# Altium schematic sheet 从机.SchDoc
size A2
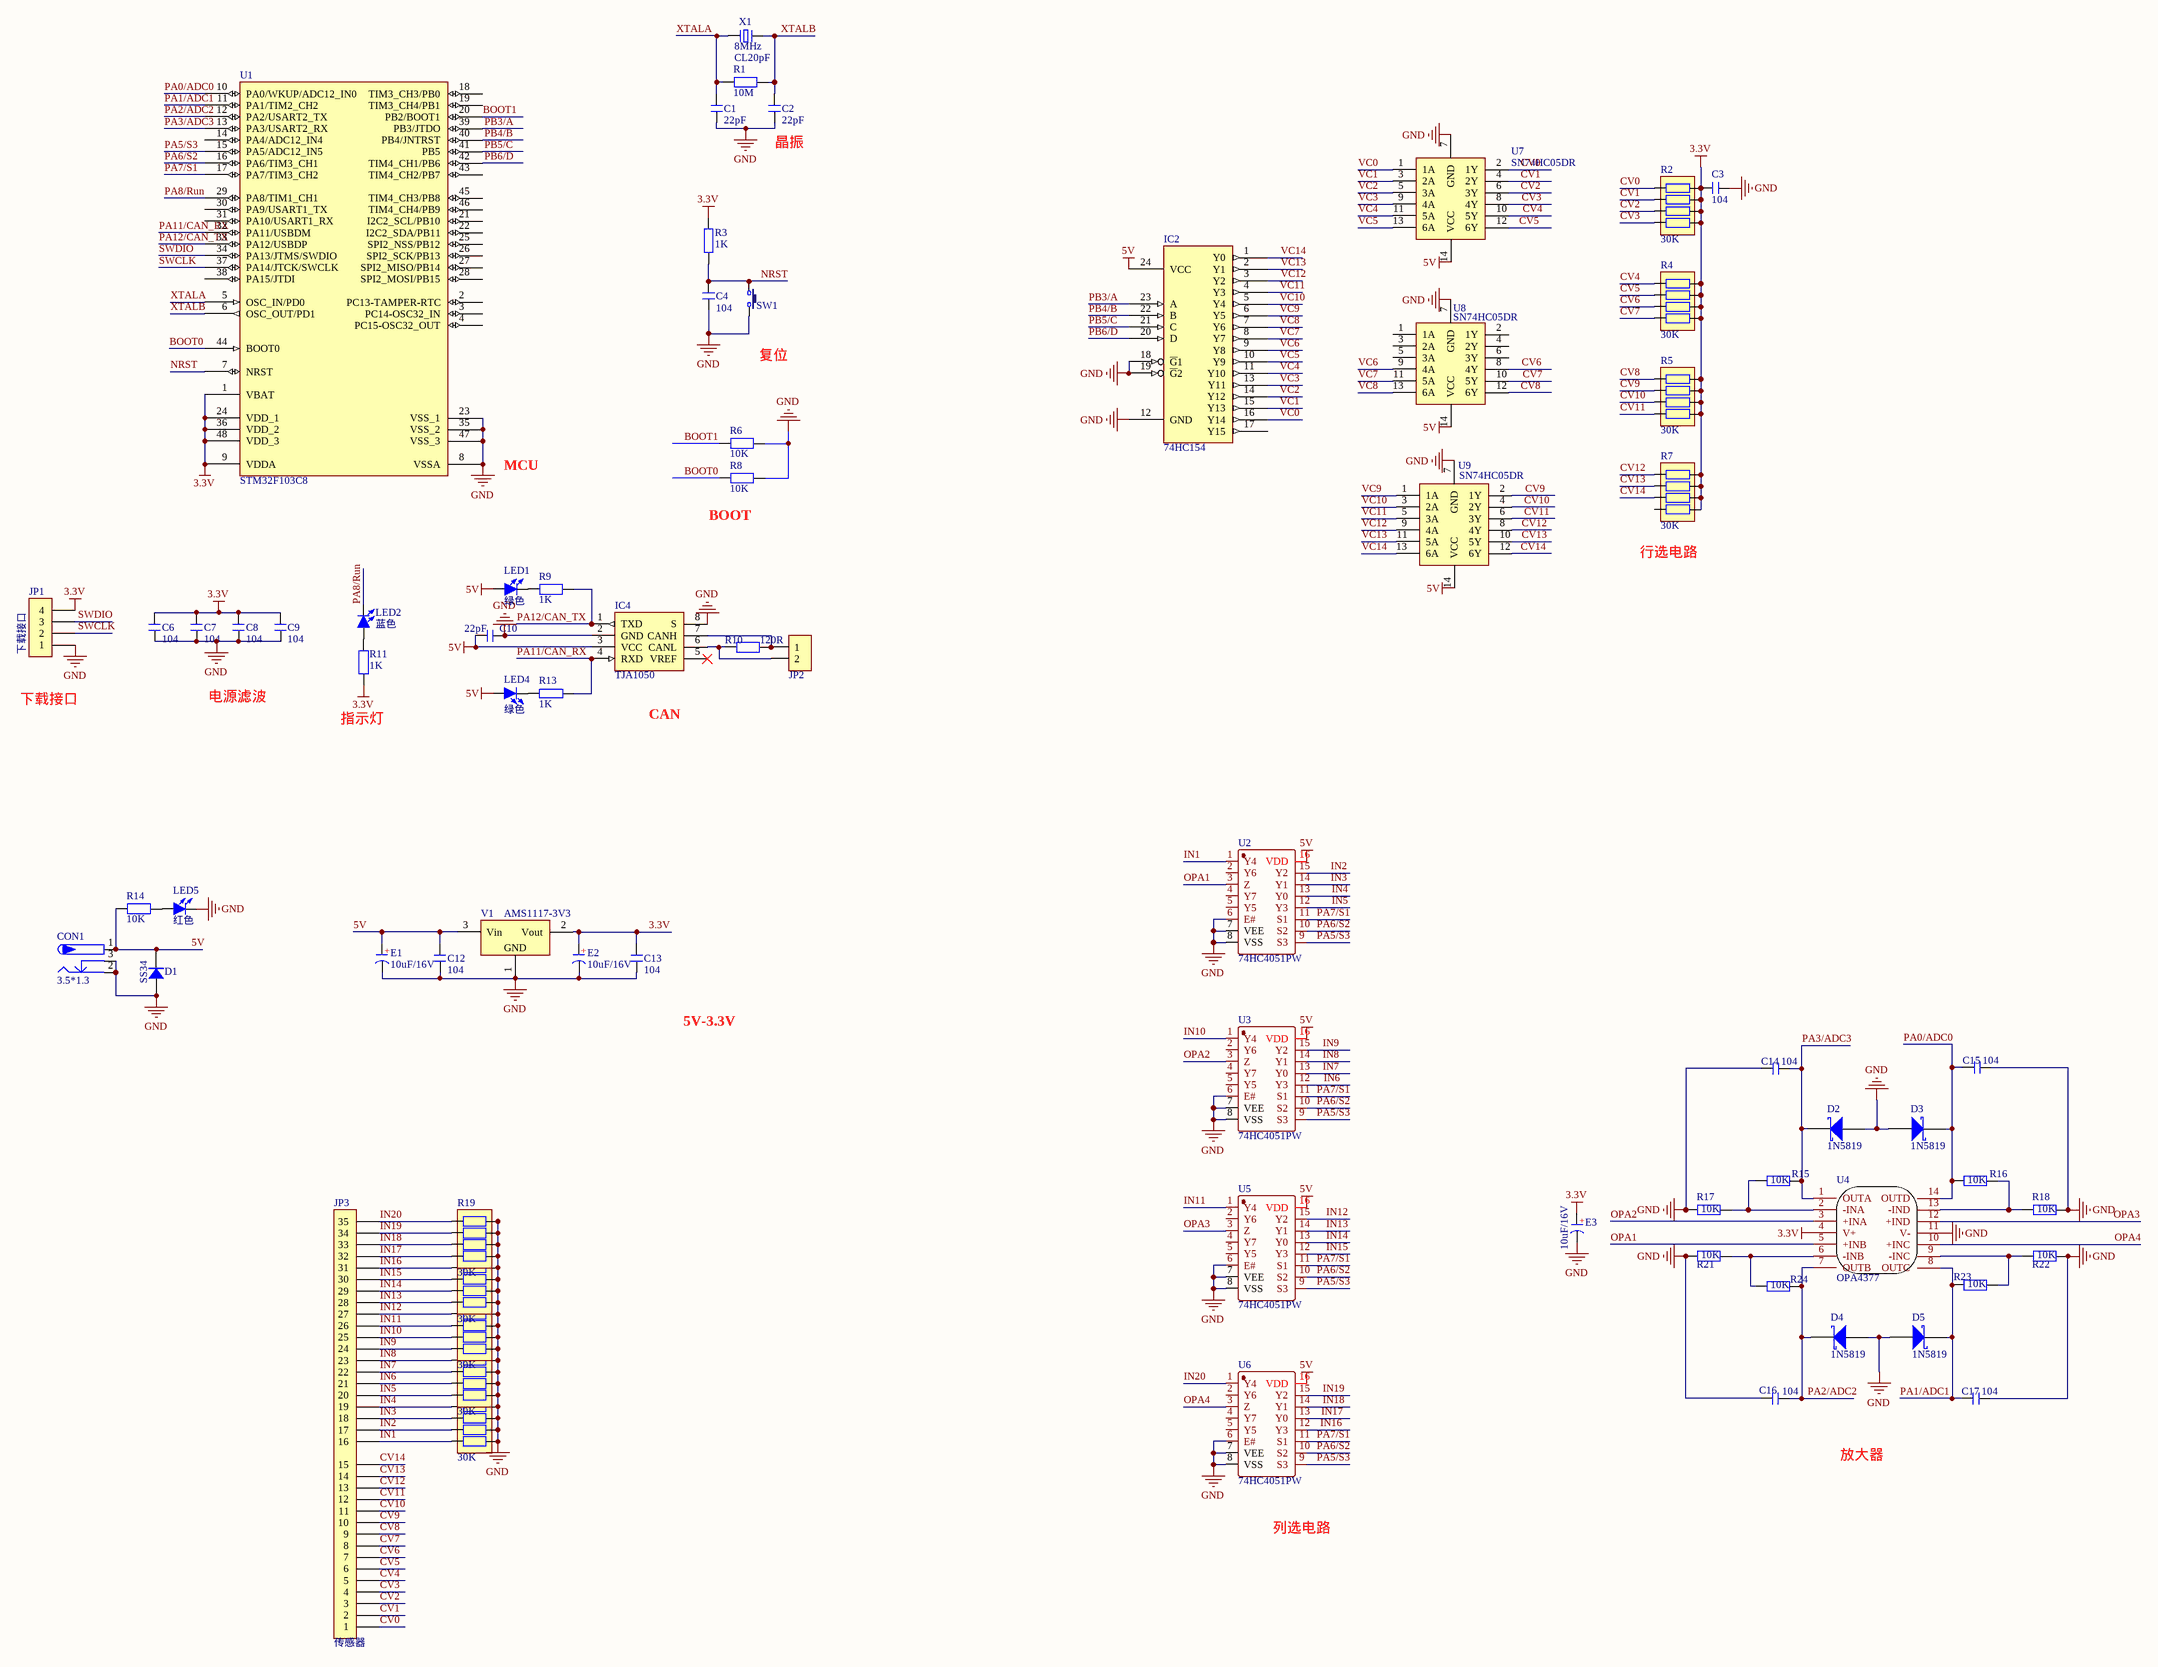
[diagram p0: 从机.SchDoc]

## Parts
C1  22pF  [C 0402_L]
C2  22pF  [C 0402_L]
C3  104  [C 0402_L]
C4  104  [C 0402_L]
C6  104  [C 0402_L]
C7  104  [C 0402_L]
C8  104  [C 0402_L]
C9  104  [C 0402_L]
C10  22pF  [C 0402_L]
C12  104  [C 0402_L]
C13  104  [C 0402_L]
C14  104  [C 0402_L]
C15  104  [C 0402_L]
C16  104  [C 0402_L]
C17  104  [C 0402_L]
CON1  3.5*1.3  [DC-005]
D1  SS34  [SMA]
D2  1N5819  [SOD-123]
D3  1N5819  [SOD-123]
D4  1N5819  [SOD-123]
D5  1N5819  [SOD-123]
E1  10uF/16V  [CD A(3216)]
E2  10uF/16V  [CD A(3216)]
E3  10uF/16V  [CD A(3216)]
IC2  74HC154  [SOP24_N]
IC4  TJA1050  [SOP8_L]
JP1  下载接口  [下载接口]
JP2  HDR-1X2  [KF350-2P]  (value not drawn)
JP3  传感器  [柔性传感器]
LED1  绿色  [LED 0603G]
LED2  蓝色  [LED 0603B]
LED4  绿色  [LED 0603G]
LED5  红色  [LED 0603R]
R1  10M  [R 0402_L]
R2  30K  [RCA-8P4R-0603]
R3  1K  [R 0402_L]
R4  30K  [RCA-8P4R-0603]
R5  30K  [RCA-8P4R-0603]
R6  10K  [R 0603_L]
R7  30K  [RCA-8P4R-0603]
R8  10K  [R 0603_L]
R9  1K  [R 0402_L]
R10  120R  [R 0402_L]
R11  1K  [R 0402_L]
R13  1K  [R 0402_L]
R14  10K  [R 0402_L]
R15  10K  [R 0402_L]
R16  10K  [R 0402_L]
R17  10K  [R 0402_L]
R18  10K  [R 0402_L]
R19  30K  [RCA-8P4R-0603]
R20  30K  [RCA-8P4R-0603]
R21  10K  [R 0402_L]
R22  10K  [R 0402_L]
R23  10K  [R 0402_L]
R24  10K  [R 0402_L]
R25  30K  [RCA-8P4R-0603]
R26  30K  [RCA-8P4R-0603]
R27  30K  [RCA-8P4R-0603]
SW1  3x6x5  [TSW SMD-3*6*2.5]  (value not drawn)
U1  STM32F103C8  [LQFP48 7X7_L]
U2  74HC4051PW  [TSSOP16_N]
U3  74HC4051PW  [TSSOP16_N]
U4  OPA4377  [TSSOP14_L]
U5  74HC4051PW  [TSSOP16_N]
U6  74HC4051PW  [TSSOP16_N]
U7  SN74HC05DR  [SOP14]
U8  SN74HC05DR  [SOP14]
U9  SN74HC05DR  [SOP14]
V1  AMS1117-3V3  [SOT223_L]
X1  8MHz  负载电容: CL20pF  [OSC 5032-2P]

## Nets
3.3V: C3.1 C6.2 C7.2 C8.2 C9.2 C13.2 E2.1(A) E3.1(A) JP1.4 R2.1 R2.2 R2.3 R2.4 R3.2 R4.1 R4.2 R4.3 R4.4 R5.1 R5.2 R5.3 R5.4 R7.1 R7.2 R7.3 R7.4 R11.2 U1.1(VBAT) U1.9(VDDA) U1.24(VDD_1) U1.36(VDD_2) U1.48(VDD_3) U4.4(V+) V1.2(Vout)
5V: C10.2 C12.2 CON1.1 D1.2(K) E1.1(A) IC2.24(VCC) IC4.3(VCC) LED1.1(A) LED4.1(A) R14.1 U2.16(VDD) U3.16(VDD) U5.16(VDD) U6.16(VDD) U7.14(VCC) U8.14(VCC) U9.14(VCC) V1.3(Vin)
GND: C1.1 C2.1 C3.2 C4.1 C6.1 C7.1 C8.1 C9.1 C10.1 C12.1 C13.1 C14.1 C15.2 C16.2 C17.2 CON1.2 CON1.3 D1.1(A) D2.1(A) D3.1(A) D4.1(A) D5.1(A) E1.2(K) E2.2(K) E3.2(K) IC2.12(GND) IC2.18(~{G}1) IC2.19(~{G}2) IC4.2(GND) IC4.8(S) JP1.1 LED5.2(K) R6.2 R8.2 R17.2 R18.1 R19.1 R19.2 R19.3 R19.4 R20.1 R20.2 R20.3 R20.4 R21.1 R22.2 R25.1 R25.2 R25.3 R25.4 R26.1 R26.2 R26.3 R26.4 R27.1 R27.2 R27.3 R27.4 SW1.2 U1.8(VSSA) U1.23(VSS_1) U1.35(VSS_2) U1.47(VSS_3) U2.6(E#) U2.7(VEE) U2.8(VSS) U3.6(E#) U3.7(VEE) U3.8(VSS) U4.11(V-) U5.6(E#) U5.7(VEE) U5.8(VSS) U6.6(E#) U6.7(VEE) U6.8(VSS) U7.7(GND) U8.7(GND) U9.7(GND) V1.1(GND)
BOOT0: R8.1 U1.44(BOOT0)
BOOT1: R6.1 U1.20(PB2/BOOT1)
CV0: JP3.1 R2.8 U7.2(1Y)
CV1: JP3.2 R2.7 U7.4(2Y)
CV2: JP3.3 R2.6 U7.6(3Y)
CV3: JP3.4 R2.5 U7.8(4Y)
CV4: JP3.5 R4.8 U7.10(5Y)
CV5: JP3.6 R4.7 U7.12(6Y)
CV6: JP3.7 R4.6 U8.8(4Y)
CV7: JP3.8 R4.5 U8.10(5Y)
CV8: JP3.9 R5.8 U8.12(6Y)
CV9: JP3.10 R5.7 U9.2(1Y)
CV10: JP3.11 R5.6 U9.4(2Y)
CV11: JP3.12 R5.5 U9.6(3Y)
CV12: JP3.13 R7.8 U9.8(4Y)
CV13: JP3.14 R7.7 U9.10(5Y)
CV14: JP3.15 R7.6 U9.12(6Y)
IN1: JP3.16 R27.8 U2.1(Y4)
IN2: JP3.17 R27.7 U2.15(Y2)
IN3: JP3.18 R27.6 U2.14(Y1)
IN4: JP3.19 R27.5 U2.13(Y0)
IN5: JP3.20 R26.8 U2.12(Y3)
IN6: JP3.21 R26.7 U3.12(Y3)
IN7: JP3.22 R26.6 U3.13(Y0)
IN8: JP3.23 R26.5 U3.14(Y1)
IN9: JP3.24 R25.8 U3.15(Y2)
IN10: JP3.25 R25.7 U3.1(Y4)
IN11: JP3.26 R25.6 U5.1(Y4)
IN12: JP3.27 R25.5 U5.15(Y2)
IN13: JP3.28 R20.8 U5.14(Y1)
IN14: JP3.29 R20.7 U5.13(Y0)
IN15: JP3.30 R20.6 U5.12(Y3)
IN16: JP3.31 R20.5 U6.12(Y3)
IN17: JP3.32 R19.8 U6.13(Y0)
IN18: JP3.33 R19.7 U6.14(Y1)
IN19: JP3.34 R19.6 U6.15(Y2)
IN20: JP3.35 R19.5 U6.1(Y4)
NRST: C4.2 R3.1 SW1.1 U1.7(NRST)
OPA1: U2.3(Z) U4.5(+INB)
OPA2: U3.3(Z) U4.3(+INA)
OPA3: U4.12(+IND) U5.3(Z)
OPA4: U4.10(+INC) U6.3(Z)
PA0/ADC0: C15.1 D3.2(K) R16.1 U1.10(PA0/WKUP/ADC12_IN0) U4.14(OUTD)
PA1/ADC1: C17.1 D5.2(K) R23.1 U1.11(PA1/TIM2_CH2) U4.8(OUTC)
PA2/ADC2: C16.1 D4.2(K) R24.2 U1.12(PA2/USART2_TX) U4.7(OUTB)
PA3/ADC3: C14.2 D2.2(K) R15.2 U1.13(PA3/USART2_RX) U4.1(OUTA)
PA5/S3: U1.15(PA5/ADC12_IN5) U2.9(S3) U3.9(S3) U5.9(S3) U6.9(S3)
PA6/S2: U1.16(PA6/TIM3_CH1) U2.10(S2) U3.10(S2) U5.10(S2) U6.10(S2)
PA7/S1: U1.17(PA7/TIM3_CH2) U2.11(S1) U3.11(S1) U5.11(S1) U6.11(S1)
PA8/Run: LED2.2(K) U1.29(PA8/TIM1_CH1)
PA11/CAN_RX: IC4.4(RXD) R13.1 U1.32(PA11/USBDM)
PA12/CAN_TX: IC4.1(TXD) R9.1 U1.33(PA12/USBDP)
PB3/A: IC2.23(A) U1.39(PB3/JTDO)
PB4/B: IC2.22(B) U1.40(PB4/JNTRST)
PB5/C: IC2.21(C) U1.41(PB5)
PB6/D: IC2.20(D) U1.42(TIM4_CH1/PB6)
SWCLK: JP1.2 U1.37(PA14/JTCK/SWCLK)
SWDIO: JP1.3 U1.34(PA13/JTMS/SWDIO)
VC0: IC2.16(Y14) U7.1(1A)
VC1: IC2.15(Y13) U7.3(2A)
VC2: IC2.14(Y12) U7.5(3A)
VC3: IC2.13(Y11) U7.9(4A)
VC4: IC2.11(Y10) U7.11(5A)
VC5: IC2.10(Y9) U7.13(6A)
VC6: IC2.9(Y8) U8.9(4A)
VC7: IC2.8(Y7) U8.11(5A)
VC8: IC2.7(Y6) U8.13(6A)
VC9: IC2.6(Y5) U9.1(1A)
VC10: IC2.5(Y4) U9.3(2A)
VC11: IC2.4(Y3) U9.5(3A)
VC12: IC2.3(Y2) U9.9(4A)
VC13: IC2.2(Y1) U9.11(5A)
VC14: IC2.1(Y0) U9.13(6A)
XTALA: C1.2 R1.1 U1.5(OSC_IN/PD0) X1.1
XTALB: C2.2 R1.2 U1.6(OSC_OUT/PD1) X1.2
NetIC4_6: IC4.6(CANL) JP2.2 R10.2
NetIC4_7: IC4.7(CANH) JP2.1 R10.1
NetLED1_2: LED1.2(K) R9.2
NetLED2_1: LED2.1(A) R11.1
NetLED4_2: LED4.2(K) R13.2
NetLED5_1: LED5.1(A) R14.2
NetR15_1: R15.1 R17.1 U4.2(-INA)
NetR16_2: R16.2 R18.2 U4.13(-IND)
NetR21_2: R21.2 R24.1 U4.6(-INB)
NetR22_1: R22.1 R23.2 U4.9(-INC)

Not connected (* = marked no-connect by the designer): IC2 17(Y15); IC4 5(VREF)*; R7 5; U1 2(PC13-TAMPER-RTC) 3(PC14-OSC32_IN) 4(PC15-OSC32_OUT) 14(PA4/ADC12_IN4) 18(TIM3_CH3/PB0) 19(TIM3_CH4/PB1) 21(I2C2_SCL/PB10) 22(I2C2_SDA/PB11) 25(SPI2_NSS/PB12) 26(SPI2_SCK/PB13) 27(SPI2_MISO/PB14) 28(SPI2_MOSI/PB15) 30(PA9/USART1_TX) 31(PA10/USART1_RX) 38(PA15/JTDI) 43(TIM4_CH2/PB7) 45(TIM4_CH3/PB8) 46(TIM4_CH4/PB9); U2 2(Y6) 4(Y7) 5(Y5); U3 2(Y6) 4(Y7) 5(Y5); U5 2(Y6) 4(Y7) 5(Y5); U6 2(Y6) 4(Y7) 5(Y5); U8 1(1A) 2(1Y) 3(2A) 4(2Y) 5(3A) 6(3Y)

## Notes on the sheet
- (near C2) 晶振
- 复位
- MCU
- (near R8) BOOT
- (near R7) 行选电路
- 下载接口
- 电源滤波
- (near R11) 指示灯
- CAN
- 5V-3.3V
- 放大器
- 列选电路
- (in symbol CT) +

## Library data of the parts
C1-C4 C6-C10 C12-C17 = C: 贴片电容; BOM名称: 无极性贴片电容; 淘宝ID: 封装库来自淘宝 ID：黄晶宝石; 联系售后，技术支持: https://shop463601444.taobao.com; 唯一出售店铺网址: https://shop463601444.taobao.com
CON1 = P-DC: 低压电源接口; BOM名称: DC电源接口; 版权归属: 源创客; 学习资源: www.ooocke.com
D1 = SS54: 肖特基二极管; 版权归属: 源创客; 属性: 40V/3A; BOM名称: 肖特基二极管; 学习资源: www.ooocke.com
D2-D5 = 1N5819: 肖特基二极管; 淘宝ID: 封装库来自淘宝 ID：黄晶宝石; 属性: 40V/2A; BOM名称: 肖特基二极管; 欢迎光临: https://shop463601444.taobao.com
E1-E3 = CT: 贴片钽电容; 淘宝ID: 封装库来自淘宝 ID：黄晶宝石; BOM名称: 贴片钽电容; 联系售后: https://shop463601444.taobao.com
IC2 = 74HC154: 4线转16线译码器; 版权归属: 源创客; BOM名称: 4线转16线译码器; 学习资源: www.ooocke.com
IC4 = TJA1050: CAN总线收发芯片; 版权归属: 封装库来自淘宝 ID：黄晶宝石; BOM名称: CAN总线收发芯片; 学习资源: https://shop463601444.taobao.com
JP1 = 下载接口: Jlink下载接口
JP2 = Header 2: 2P接插件; 版权归属: 封装库来自淘宝卖家 ID：黄晶宝石; BOM名称: 2P接插件; 技术支持，联系售后: https://shop463601444.taobao.com
JP3 = 传感器: 浙清柔性阵列传感器
LED1 LED2 LED4 LED5 = LED-SMD: 贴片LED; 版权归属: 封装库来自淘宝 ID：黄晶宝石; BOM名称: 贴片LED; 学习资源: https://shop463601444.taobao.com
R1 R3 R6 R8-R11 R13-R18 R21-R24 = R: 贴片电阻; 版权归属: 来自淘宝 ID：黄晶宝石; 封装库来自淘宝卖家 ID：黄晶宝石: 其他店铺购入均为盗版，不享受售后技术支持服务，请立即申请退款; BOM名称: 贴片电阻; 联系售后: https://shop463601444.taobao.com
R2 R4 R5 R7 R19 R20 R25-R27 = R-8P4R: 贴片排阻; BOM名称: 贴片网络排阻; 版权归属: 封装库来自淘宝 ID：黄晶宝石; 联系售后: https://shop463601444.taobao.com
SW1 = TSW 3x6: 3x6轻触开关; 版权归属: 源创客; BOM名称: 3x6轻触开关; 学习资源: www.ooocke.com
U1 = STM32F103C8: Flaah:64/RAM:20/IO:36; BOM名称: 32位STM单片机; 版权归属: 源创客; 学习资源: www.ooocke.com
U4 = OPA4377: 4路运放
V1 = AMS1117: 三端稳压芯片; BOM名称: 稳压芯片; 淘宝ID: 封装库来自淘宝 ID：黄晶宝石; 欢迎光临淘宝店铺: https://shop463601444.taobao.com
X1 = XTAL-2P: 2脚无源脚晶振; 版权归属: 源创客; BOM名称: 2脚无源脚晶振; 学习资源: www.ooocke.com